# EAGLE design bmi160_breakout (EAGLE 6.5.0)
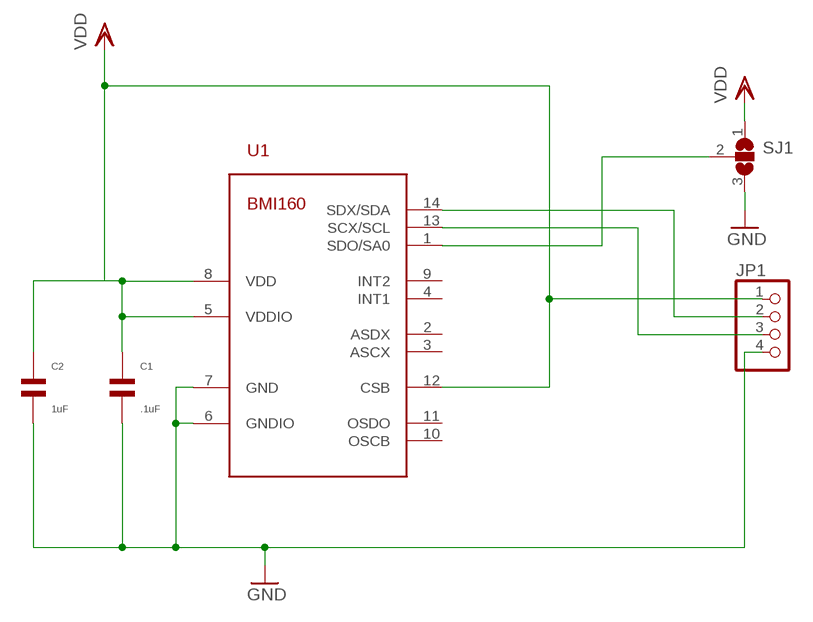
[diagram p0: schematic, sheet 1]

## Parts
C1  .1uF  CAPACITOR_NP_0603  [C0603]
C2  1uF  CAPACITOR_NP_0805  [C0805]
JP1  PINHD-1X4  [1X04]
SJ1  SJ2W  [SJ_2]
U1  BMI160LGA14  [LGA14]

## Nets
GND: C1.P$2 C2.P$2 JP1.4 SJ1.3 U1.6(GNDIO) U1.7(GND)
N$1: SJ1.2 U1.1(SDO/SA0)
SCL: JP1.3 U1.13(SCX/SCL)
SDA: JP1.2 U1.14(SDX/SDA)
VDD: C1.P$1 C2.P$1 JP1.1 SJ1.1 U1.5(VDDIO) U1.8(VDD) U1.12(CSB)
Unconnected: U1.2(ASDX) U1.3(ASCX) U1.4(INT1) U1.9(INT2) U1.10(OSCB) U1.11(OSDO)

## Library data of the parts
C1 = mfpassives:CAPACITOR_NP: Library: MF_Passives Description: Device for Non-Polarized Capacitors. Manufacture part number (MFG#), Voltage, Temperature Coefficient, and Tolerance can be added via Attributes.; AMFPN: MF-CAP-0603-0.1uF; MFG#: N/A; TEMP_COF: N/A; TOLERANCE: N/A; VOLTAGE: N/A
C2 = mfpassives:CAPACITOR_NP: Library: MF_Passives Description: Device for Non-Polarized Capacitors. Manufacture part number (MFG#), Voltage, Temperature Coefficient, and Tolerance can be added via Attributes.; AMFPN: MF-CAP-0805-1uF; MFG#: N/A; TEMP_COF: N/A; TOLERANCE: N/A; VOLTAGE: N/A
JP1 = pinhead:PINHD-1X4: PIN HEADER
SJ1 = jumper:SJ2W: SMD solder JUMPER
U1 = bmi160_breakout:BMI160; MOUSER_PN: 262-BMI160; MPN: BMI160

## Net classes
0 default: width 0.203 mm

## Board
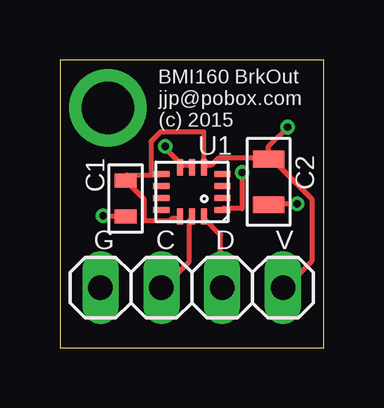
[diagram p1: board, top side]
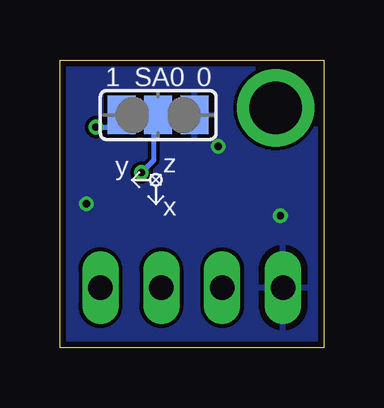
[diagram p2: board, bottom side, seen from below]

Size 11 x 12 mm. Coordinates in mm from the lower left corner, seen from the top.
Outline: 0,0 11,0 11,12 0,12 0,0
Copper layers (1*16): Top 0.035mm / dielectric 0.2mm / Bottom 0.035mm
Design rules "MF_2_Layer": minimum track width 6mil, minimum drill 12mil, track to track 6mil, track to pad 6mil, pad to pad 6mil, via to via 6mil, smd to smd 0mil, copper to edge 10mil, drill to drill 10mil, minimum pad ring 6mil, minimum via ring 6mil, stop-mask expansion 2mil, vias tented up to drill 25mil, thermal gap 10mil
tRestrict: area 4.7,6 to 6.3,7
vRestrict: area 4.7,6 to 6.3,7

### Footprints (pad centres in the part's own frame; a part is rotated, then mirrored left to right if it is on the bottom)
C0603 = smd 0.6 x 0.9: P$1 -0.75,0; P$2 0.75,0
C0805 = smd 0.7 x 1.3: P$1 -0.95,0; P$2 0.95,0
1X04 = drill 1.016 long: 1 -3.81,0; 2 -1.27,0; 3 1.27,0; 4 3.81,0
SJ_2 = smd 1.168 x 1.6: 1 -1.524,0; 2 0,0; 3 1.524,0
LGA14 = smd 0.675 x 0.25: 1 -1.275,0.75; 2 -1.275,0.25; 3 -1.275,-0.25; 4 -1.275,-0.75; 8 1.275,-0.75; 9 1.275,-0.25; 10 1.275,0.25; 11 1.275,0.75 | smd 0.25 x 0.675: 5 -0.5,-1.025; 6 0,-1.025; 7 0.5,-1.025; 12 0.5,1.025; 13 0,1.025; 14 -0.5,1.025

### Placement (x,y rotation side)
C1  2.74,6.22 270 top
C2  8.71,6.91 270 top
JP1  5.5,2.5 180 top
SJ1  6.9,9.7 0 bottom
U1  5.5,6.5 180 top

### Tracks (layer width: path | path; a pad name or v marks a point on that pad's centre or on a via)
GND  (via drill 0.3)
  Top 0.203: U1.6 5.5,7.6 5,7.6 U1.7 5,7.7 4.4,8.3 v4.4,8.4 | v1.8,5.5 2.7,5.5 C1.P$2 | v9.9,6 8.8,6 C2.P$2
  pour Bottom: 0.3,11.7 0.3,0.3 10.7,0.3 10.7,11.7
N$1  (via drill 0.3)
  Top 0.203: v7.6,7.3 7.6,5.8 6.8,5.8 U1.1
  Bottom 0.203: v7.6,7.3 7.1,7.8 7.1,9.7 SJ1.2
N$3  (via drill 2.2)
  other vias: 2,10
SCL
  Top 0.203: U1.13 5.5,5.4 5.4,5.3 5.4,3.6 4.3,2.5 JP1.3
SDA
  Top 0.203: U1.14 6,5.4 6.7,4.7 6.7,2.5 JP1.2
VDD  (via drill 0.3)
  Top 0.203: U1.12 5,5.4 4.7,5.4 4.6,5.3 3.5,5.3 3.5,6.2 2.8,6.9 C1.P$1 2.8,7 2.8,7.2 3.8,7.2 | 3.8,7.2 4.2,7.2 U1.8 | C2.P$1 8.7,7.9 6.6,7.9 6.3,7.6 6,7.6 U1.5 6,9 4.2,9 3.8,8.6 3.8,7.2 | v9.5,9.2 8.7,8.4 8.7,8 C2.P$1 | JP1.1 9.4,2.5 10.5,3.6 10.5,6.2 8.8,7.9 C2.P$1
  Bottom 0.203: v9.5,9.2 9,9.2 8.5,9.7 SJ1.1

### Text on the board
tPlace: BMI160 BrkOut | jjp@pobox.com | (c) 2015 | G | C | D | V
bPlace: 0 | SA0 | 1 | z | y | x